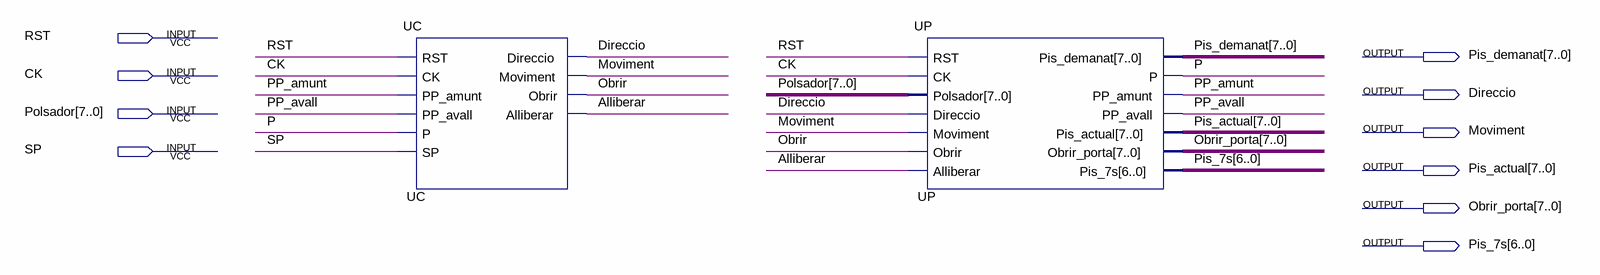
[diagram p0: schematic sheet]
// Quartus schematic ControlAscensor.bdf as structural Verilog: 2 symbols, 10 pins
module ControlAscensor (
  input  RST,
  input  CK,
  input  [7:0] Polsador,
  input  SP,
  output [7:0] Pis_demanat,
  output Direccio,
  output Moviment,
  output [7:0] Pis_actual,
  output [7:0] Obrir_porta,
  output [6:0] Pis_7s
);

  wire Alliberar, Obrir, P, PP_amunt, PP_avall;

  UC UC (
    .RST(RST), .CK(CK), .PP_amunt(PP_amunt), .PP_avall(PP_avall), .P(P), .SP(SP), .Direccio(Direccio),
    .Moviment(Moviment), .Obrir(Obrir), .Alliberar(Alliberar));
  UP UP (
    .RST(RST), .CK(CK), .Polsador(Polsador), .Direccio(Direccio), .Moviment(Moviment), .Obrir(Obrir),
    .Alliberar(Alliberar), .Pis_demanat(Pis_demanat), .P(P), .PP_amunt(PP_amunt), .PP_avall(PP_avall),
    .Pis_actual(Pis_actual), .Obrir_porta(Obrir_porta), .Pis_7s(Pis_7s));
endmodule
